# Altium schematic sheet ios.SchDoc
size A4; DocumentNumber: 7; SheetNumber: 7; SheetTotal: 7
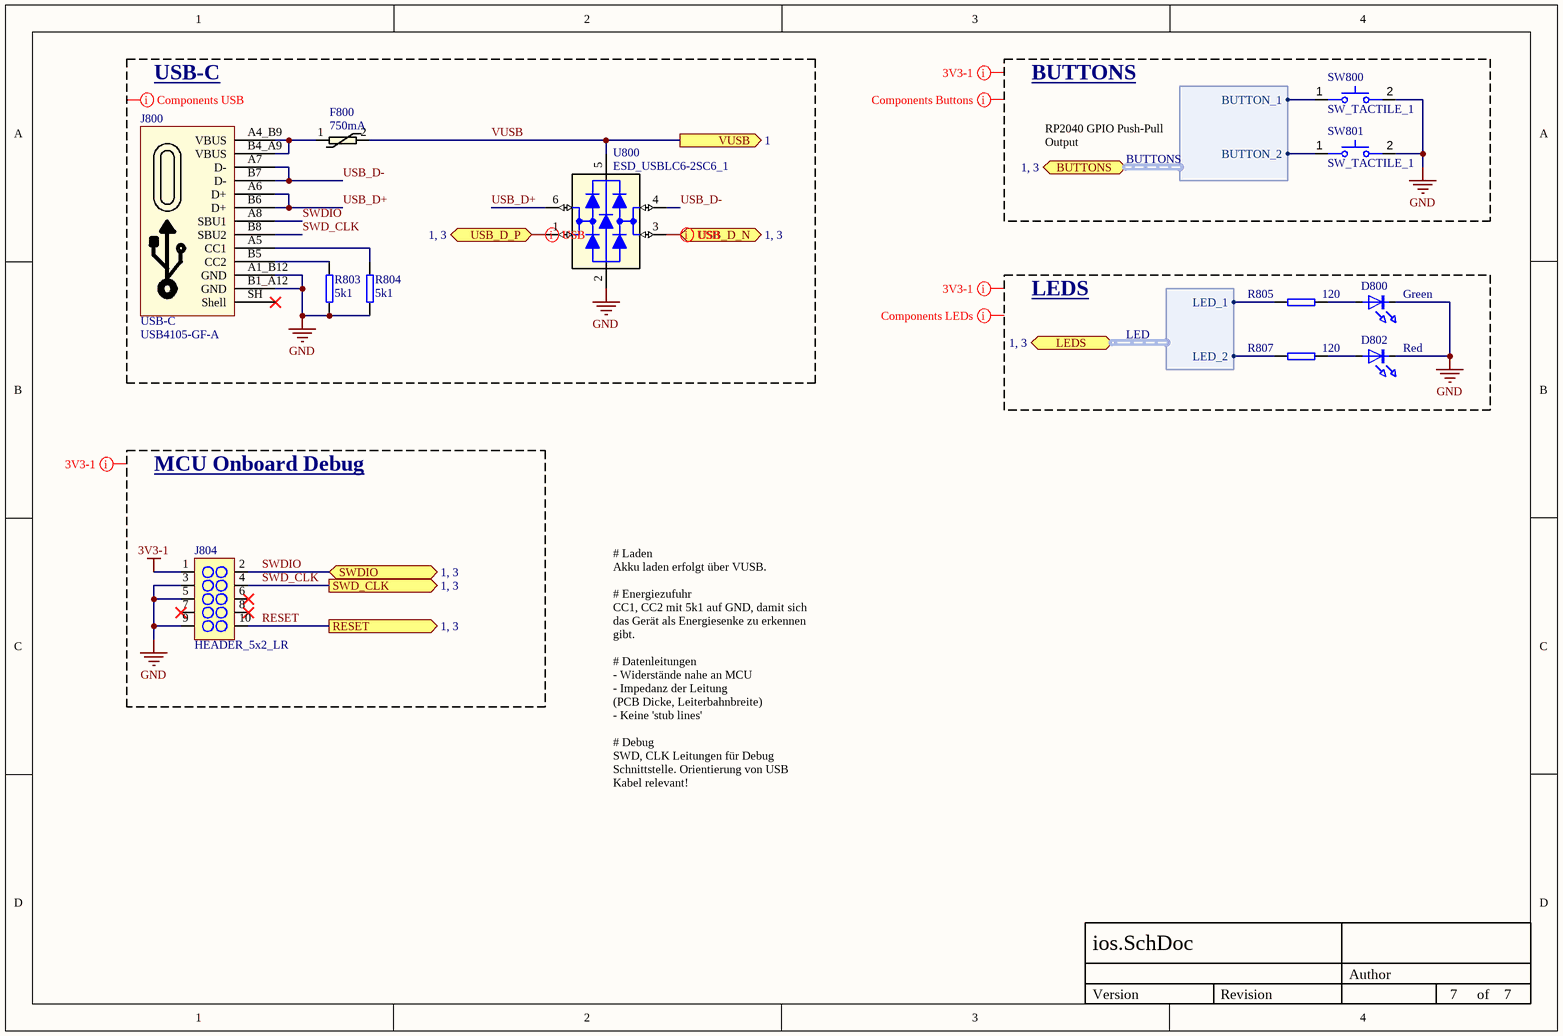
[diagram p0: ios.SchDoc]

## Parts
D800  Green  [0603-Diode]
D802  Red  [0603-Diode]
F800  750mA  [1206]
J800  USB-C  value USB4105-GF-A  [USB_GCT_4105-GF-A]
J804  HEADER_5x2_LR  [HEADER_SMD_1.27]
R803  5k1  [0603]
R804  5k1  [0603]
R805  120  [0603]
R807  120  [0603]
SW800  SW_TACTILE_1  [SWITCH_B3FS1010P]
SW801  SW_TACTILE_1  [SWITCH_B3FS1010P]
U800  ESD_USBLC6-2SC6_1  [SOT95P280X145-6N]

## Ports
BUTTONS (bidir, harness BUTTONS, see 1, 3), LEDS (bidir, harness LED, see 1, 3), RESET (out, see 1, 3), SWD_CLK (out, see 1, 3), SWDIO (bidir, see 1, 3), USB_D_N (bidir, see 1, 3), USB_D_P (bidir, see 1, 3), VUSB (out, see 1)

## Harnesses
LED: LED_2, LED_1
BUTTONS: BUTTON_2, BUTTON_1

## Nets
3V3-1: J804.1
GND: D800.K D802.K J800.A1_B12(GND) J800.B1_A12(GND) J804.3 J804.5 J804.9 R803.1 R804.1 SW800.2 SW801.2 U800.2(GND)
RESET: J804.10 ; port RESET
SWD_CLK: J800.B8(SBU2) J804.4 ; port SWD_CLK
SWDIO: J800.A8(SBU1) J804.2 ; port SWDIO
USB_D+: J800.A6(D+) J800.B6(D+) U800.6(I/O1_OUT)
USB_D-: J800.A7(D-) J800.B7(D-) U800.4(I/O2_OUT)
USB_D_N: U800.3(I/O2_IN) ; port USB_D_N
USB_D_P: U800.1(I/O1_IN) ; port USB_D_P
VUSB: F800.2 U800.5(VBUS) ; port VUSB
NetD800_A: D800.A R805.1
NetD802_A: D802.A R807.1
NetF800_1: F800.1 J800.A4_B9(VBUS) J800.B4_A9(VBUS)
NetJ800_A5: J800.A5(CC1) R804.2
NetJ800_B5: J800.B5(CC2) R803.2
NetR805_2: R805.2 ; port LEDS.LED_1
NetR807_2: R807.2 ; port LEDS.LED_2
NetSW800_1: SW800.1 ; port BUTTONS.BUTTON_1
NetSW801_1: SW801.1 ; port BUTTONS.BUTTON_2

Not connected (* = marked no-connect by the designer): J800 SH(Shell)*; J804 6* 7* 8*

## Layout directives
net class 3V3-1: 3V3-1, GND, RESET, SWD_CLK, SWDIO
CompClassName: IO_USB: GND, SWD_CLK, SWDIO, USB_D+, USB_D-, VUSB
CompClassName: IO_BUTTONS: GND
CompClassName: IO_LEDS: GND
differential pair: USB_D_N, USB_D_P

## Notes on the sheet
- USB-C
- BUTTONS
- RP2040 GPIO Push-Pull Output
- LEDS
- MCU Onboard Debug
- # Laden
  Akku laden erfolgt über VUSB.
  # Energiezufuhr
  CC1, CC2 mit 5k1 auf GND, damit sich das Gerät als Energiesenke zu erkennen gibt.
  # Datenleitungen
  - Widerstände nahe an MCU
  - Impedanz der Leitung
  (PCB Dicke, Leiterbahnbreite)
  - Keine 'stub lines'
  # Debug
  SWD, CLK Leitungen für Debug Schnittstelle. Orientierung von USB Kabel relevant!
- Author
- Version
- Revision
- of

## Library data of the parts
D800 D802 = LED_1
F800 = FUSE_1: Resettable Fuse
J800 = USB-C_2: Connector 24 (16+8 Dummy)
R803-R805 R807 = R?: Normaler Widerstand
  R805 R807: Value: 120
U800 = ESD_USBLC6-2SC6_1: 17V Clamp 5A (8/20Âµs) Ipp Tvs Diode Surface Mount SOT-23-6; MF: STMicroelectronics; Value: *; SnapEDA_Link: https://www.snapeda.com/parts/USBLC6-2SC6/STMicroelectronics/view-part/?ref=snap; Check_prices: https://www.snapeda.com/parts/USBLC6-2SC6/STMicroelectronics/view-part/?ref=eda; Purchase-URL: https://pricing.snapeda.com/search/part/USBLC6-2SC6/?ref=eda; Price: None; Availability: In Stock; Package: SOT-23-6 STMicroelectronics; MP: USBLC6-2SC6